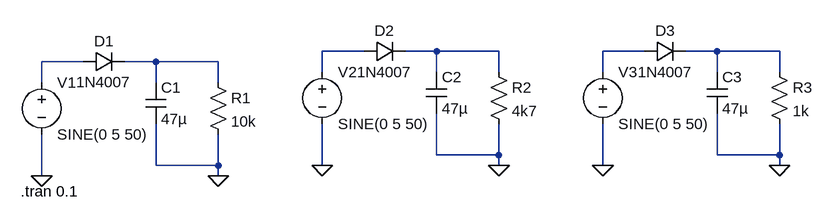
[diagram p0: schematic Simu punto C2.asc]
Simu punto C2.asc, the LTspice schematic file:
Version 4
SHEET 1 1172 680
WIRE 464 112 400 112
WIRE 576 112 528 112
WIRE 672 112 576 112
WIRE 896 112 832 112
WIRE 1008 112 960 112
WIRE 1104 112 1008 112
WIRE 32 128 -32 128
WIRE 144 128 96 128
WIRE 240 128 144 128
WIRE 400 144 400 112
WIRE 576 144 576 112
WIRE 672 144 672 112
WIRE 832 144 832 112
WIRE 1008 144 1008 112
WIRE 1104 144 1104 112
WIRE -32 160 -32 128
WIRE 144 160 144 128
WIRE 240 160 240 128
WIRE 576 272 576 208
WIRE 672 272 672 224
WIRE 672 272 576 272
WIRE 1008 272 1008 208
WIRE 1104 272 1104 224
WIRE 1104 272 1008 272
WIRE 144 288 144 224
WIRE 240 288 240 240
WIRE 240 288 144 288
WIRE 400 288 400 224
WIRE 672 288 672 272
WIRE 832 288 832 224
WIRE 1104 288 1104 272
WIRE -32 304 -32 240
WIRE 240 304 240 288
FLAG 240 304 0
FLAG -32 304 0
FLAG 672 288 0
FLAG 400 288 0
FLAG 1104 288 0
FLAG 832 288 0
SYMBOL diode 32 144 R270
WINDOW 0 32 32 VTop 2
WINDOW 3 0 32 VBottom 2
SYMATTR InstName D1
SYMATTR Value 1N4007
SYMBOL cap 128 160 R0
SYMATTR InstName C1
SYMATTR Value 47µ
SYMBOL res 224 144 R0
SYMATTR InstName R1
SYMATTR Value 10k
SYMBOL voltage -32 144 R0
WINDOW 123 0 0 Left 0
WINDOW 39 0 0 Left 0
SYMATTR InstName V1
SYMATTR Value SINE(0 5 50)
SYMBOL diode 464 128 R270
WINDOW 0 32 32 VTop 2
WINDOW 3 0 32 VBottom 2
SYMATTR InstName D2
SYMATTR Value 1N4007
SYMBOL cap 560 144 R0
SYMATTR InstName C2
SYMATTR Value 47µ
SYMBOL res 656 128 R0
SYMATTR InstName R2
SYMATTR Value 4k7
SYMBOL voltage 400 128 R0
WINDOW 123 0 0 Left 0
WINDOW 39 0 0 Left 0
SYMATTR InstName V2
SYMATTR Value SINE(0 5 50)
SYMBOL diode 896 128 R270
WINDOW 0 32 32 VTop 2
WINDOW 3 0 32 VBottom 2
SYMATTR InstName D3
SYMATTR Value 1N4007
SYMBOL cap 992 144 R0
SYMATTR InstName C3
SYMATTR Value 47µ
SYMBOL res 1088 128 R0
SYMATTR InstName R3
SYMATTR Value 1k
SYMBOL voltage 832 128 R0
WINDOW 123 0 0 Left 0
WINDOW 39 0 0 Left 0
SYMATTR InstName V3
SYMATTR Value SINE(0 5 50)
TEXT -64 328 Left 2 !.tran 0.1

The netlist it stands for:
* Simu punto C2.asc
D1 N005 N006 1N4007
C1 N006 0 47µ
R1 N006 0 10k
V1 N005 0 SINE(0 5 50)
D2 N001 N002 1N4007
C2 N002 0 47µ
R2 N002 0 4k7
V2 N001 0 SINE(0 5 50)
D3 N003 N004 1N4007
C3 N004 0 47µ
R3 N004 0 1k
V3 N003 0 SINE(0 5 50)
.model D D
.lib standard.dio
.tran 0.1
.backanno
.end